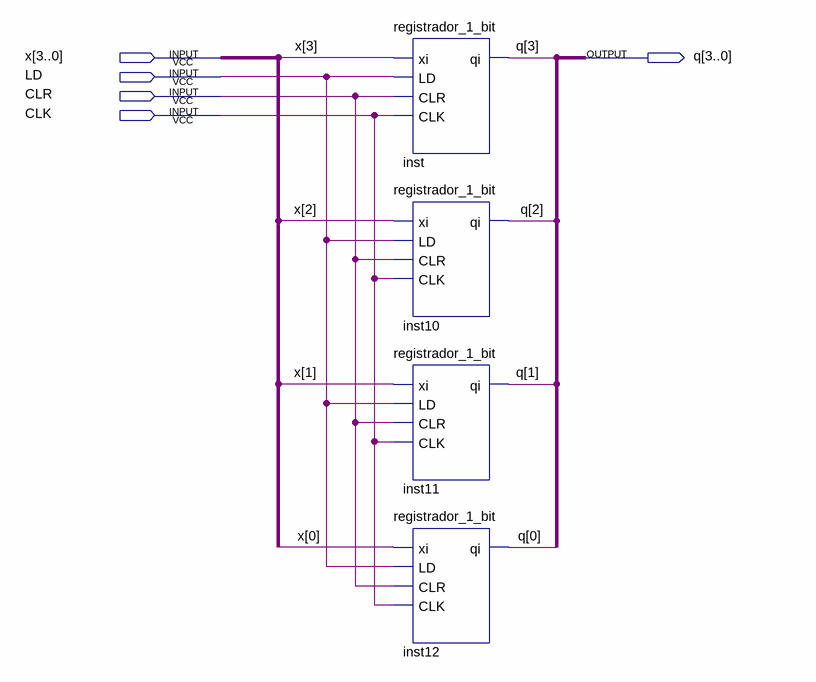
[diagram p0: schematic sheet]
// Quartus schematic registrador_4_bits.bdf as structural Verilog: 4 symbols, 5 pins
module registrador_4_bits (
  input  [3:0] x,
  input  LD,
  input  CLR,
  input  CLK,
  output [3:0] q
);

  registrador_1_bit inst (.LD(LD), .xi(x[3]), .CLR(CLR), .CLK(CLK), .qi(q[3]));
  registrador_1_bit inst10 (.LD(LD), .xi(x[2]), .CLR(CLR), .CLK(CLK), .qi(q[2]));
  registrador_1_bit inst11 (.LD(LD), .xi(x[1]), .CLR(CLR), .CLK(CLK), .qi(q[1]));
  registrador_1_bit inst12 (.LD(LD), .xi(x[0]), .CLR(CLR), .CLK(CLK), .qi(q[0]));
endmodule
